# Altium schematic sheet Arming.SchDoc
size A
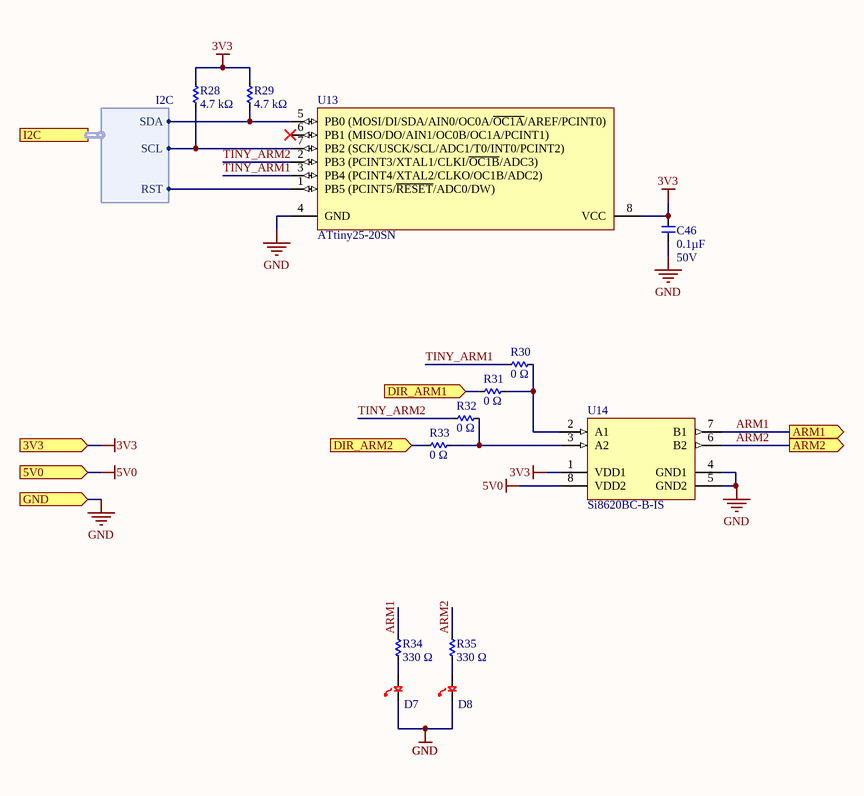
[diagram p0: Arming.SchDoc]

## Parts
C46  Capacitance (shorthand): 0.1µF  Rated Voltage: 50V  [C0603]  (hidden comment: __template_cap)
D7  LED_LY974  [0805_Diode]  (value not drawn)
D8  LED_LY974  [0805_Diode]  (value not drawn)
R28  Resistance: 4.7 kΩ  [R0603]  (hidden comment: __template_resistor)
R29  Resistance: 4.7 kΩ  [R0603]  (hidden comment: __template_resistor)
R30  Resistance: 0 Ω  [R0603]  (hidden comment: __template_resistor)
R31  Resistance: 0 Ω  [R0603]  (hidden comment: __template_resistor)
R32  Resistance: 0 Ω  [R0603]  (hidden comment: __template_resistor)
R33  Resistance: 0 Ω  [R0603]  (hidden comment: __template_resistor)
R34  Resistance: 330 Ω  [R0603]  (hidden comment: __template_resistor)
R35  Resistance: 330 Ω  [R0603]  (hidden comment: __template_resistor)
U13  ATtiny25-20SN  [8S2_N]
U14  Si8620BC-B-IS  [SLAB-SOIC-8-NB_N]

## Ports
3V3 (in), 5V0 (in), ARM1 (out), ARM2 (out), DIR_ARM1 (in), DIR_ARM2 (in), GND (in), I2C (harness I2C)

## Harnesses
I2C: SCL, SDA, RST

## Nets
3V3: C46.1 R28.2 R29.2 U13.8(VCC) U14.1(VDD1) ; port 3V3
5V0: U14.8(VDD2) ; port 5V0
GND: C46.2 D7.1 D8.1 U13.4(GND) U14.4(GND1) U14.5(GND2) ; port GND
ARM1: R34.2 U14.7(B1) ; port ARM1
ARM2: R35.2 U14.6(B2) ; port ARM2
DIR_ARM1: R31.2 ; port DIR_ARM1
DIR_ARM2: R33.2 ; port DIR_ARM2
TINY_ARM1: R30.2 U13.3(PB4_(PCINT4/XTAL2/CLKO/OC1B/ADC2))
TINY_ARM2: R32.2 U13.2(PB3_(PCINT3/XTAL1/CLKI/~{OC1B}/ADC3))
NetD7_2: D7.2 R34.1
NetD8_2: D8.2 R35.1
NetR28_1: R28.1 U13.7(PB2_(SCK/USCK/SCL/ADC1/T0/INT0/PCINT2)) ; port I2C.SCL
NetR29_1: R29.1 U13.5(PB0_(MOSI/DI/SDA/AIN0/OC0A/~{OC1A}/AREF/PCINT0)) ; port I2C.SDA
NetR30_1: R30.1 R31.1 U14.2(A1)
NetR32_1: R32.1 R33.1 U14.3(A2)
NetU13_1: U13.1(PB5_(PCINT5/~{RESET}/ADC0/DW)) ; port I2C.RST

Not connected (* = marked no-connect by the designer): U13 6(PB1_(MISO/DO/AIN1/OC0B/OC1A/PCINT1))*

## Library data of the parts
C46 = 490-1519-1-ND: CAP CER 0603 0.1µF X7R 50V 10%; Manufacturer: Murata Electronics North America; Capacitance - pF (Machine readable): #NAME?; type: capacitor; Supplier Part Number 1: 490-1519-1-ND; Dielectric: X7R; Supplier 1: Digikey
D7 D8 = LED_LY974: LED 0805 RED 20MA; Manufacturer: OSRAM Opto Semiconductors Inc; Manufacturer Part Number: LH R974-LP-1; Wavelength - Dominant: 645nm; Wavelength - Peak: 660nm; Millicandela Rating: 41mcd; Voltage - Forward (Vf) (Typ): 1.8V; Viewing Angle: 160°; Lens Transparency: Diffused; Lens Color: White; Lens Style/Size: Rectangle with Flat Top, 1.30mm x 1.25mm; Supplier 1: Digi-Key; RoHS: RoHS Compliant; Category: Optoelectronics; Stock 1: 66379; Pricing 1: 1=0.08, 10=0.07, 100=0.0559, 250=0.04892, 500=0.04472 (USD); Packaging: Cut Tape (CT); Color: Red; Package / Case: 0805 (2012 Metric); Supplier Device Package: *; Size / Dimension: 2.00mm L x 1.25mm W; Height (Max): 0.80mm; Mounting Type: Surface Mount; ComponentLink1URL: http://www.osram-os.com/Graphics/XPic8/00078869_0.pdf; ComponentLink1Description: http://www.osram-os.com/Graphics/XPic8/00078869_0.pdf; Supplier Part Number 1: 475-1415-1-ND; Current - Test: 20mA
R28 R29 = 311-4.70KHRCT-ND: RES SMD 4.7K OHM 1% 1/10W 0603; Manufacturer Part Number: RC0603FR-074K7L; Manufacturer: Yageo; Resistance (Sortable): 4700; Power (Watts): 0.1W, 1/10W; Temperature Coefficient: ±100ppm/°C; Supplier Part Number 1: 311-4.70KHRCT-ND; Supplier 1: Digikey; Datasheets: http://www.yageo.com/documents/recent/PYu-RC_Group_51_RoHS_L_9.pdf; Image: //media.digikey.com/Renders/Yageo%20Renders/0603-(1608-Metric).jpg; Tolerance: ±1%; Operating Temperature: -55°C ~ 155°C
R30-R33 = 311-0.0HRCT-ND: RES SMD 0 OHM JUMPER 1/10W 0603; Manufacturer Part Number: RC0603FR-070RL; Manufacturer: Yageo; Resistance (Sortable): 0; Power (Watts): 0.1W, 1/10W; Supplier Part Number 1: 311-0.0HRCT-ND; Supplier 1: Digikey; Datasheets: http://www.yageo.com/documents/recent/PYu-RC_Group_51_RoHS_L_9.pdf; Image: //media.digikey.com/Renders/Yageo%20Renders/0603-(1608-Metric).jpg; Tolerance: Jumper; Temperature Coefficient: -; Operating Temperature: -55°C ~ 155°C
R34 R35 = 311-330HRCT-ND: RES SMD 330 OHM 1% 1/10W 0603; Manufacturer Part Number: RC0603FR-07330RL; Manufacturer: Yageo; Resistance (Sortable): 330; Power (Watts): 0.1W, 1/10W; Temperature Coefficient: ±100ppm/°C; Supplier 1: Digikey; Datasheets: http://www.yageo.com/documents/recent/PYu-RC_Group_51_RoHS_L_9.pdf; Image: //media.digikey.com/Renders/Yageo%20Renders/0603-(1608-Metric).jpg; Supplier Part Number 1: 311-330HRCT-ND; Tolerance: ±1%; Operating Temperature: -55°C ~ 155°C
U13 = CMP-0093-00348-1: 8-bit AVR Microcontroller, 20MHz, 2.7-5.5V, 2KB Flash, 128 Bytes EEPROM, 128 Bytes SRAM, 8-pin SOP, Industrial Grade (-40°C to 105°C), Pb-Free; PackageVersion: revF, Apr-2008; DatasheetVersion: revN, Apr-2011; PackageReference: 8S2; ComponentLink1URL: http://www.atmel.com/; ComponentLink3Description: ATtiny25/45/85 Summary; PackageDescription: 8-Lead, 0.208" Body, Plastic Small Outline Package (EIAJ); ComponentLink2Description: ATtiny25/45/85 Datasheet; ComponentLink2URL: http://www.atmel.com/dyn/resources/prod_documents/doc2586.pdf; ComponentLink3URL: http://www.atmel.com/dyn/resources/prod_documents/2586S.pdf; ComponentLink1Description: Manufacturer URL
U14 = CMP-0512-00372-1: Low-Power Single and Dual-Channel Digital Isolator, 150 Mbps, 3.75 kVRMS Isolation Rating, -40 to 125 degC, 8-pin SOIC; Manufacturer: Silicon Labs; Isolation Rating (kV): 3.75; Channel Type: Unidirectional; AEC-Q100: TRUE; Sub-Family: Isolators; Maximum Propagation Delay (ns): 13; 10kV surge: FALSE; Maximum Data Rate (Mbps): 150; DatasheetVersion: Rev. 1.3; ComponentLink3URL: http://www.silabs.com/Support%20Documents/TechnicalDocs/Si8220-21.pdf; PackageDescription: 8-Pin Narrow Body Plastic Small Outline, Body 4.9 x 3.9 mm, Pitch 1.27 mm; ComponentLink2Description: Datasheet; ComponentLink3Description: Package Specification; ComponentLink1URL: http://www.silabs.com/; ComponentLink1Description: Manufacturer URL; Mounting Technology: Surface Mount; PartNumber: Si8620BC-B-IS; ComponentLink2URL: http://www.silabs.com/Support%20Documents/TechnicalDocs/Si861x-2x.pdf; Enable Control: FALSE; PackageReference: SOIC-8-NB